# Altium schematic sheet LPF를 갖는 저항분압회로를 이용한 380V입력 전압센싱 회로1 20230822.SchDoc: 380Vac Sensing Using Resistor Divider
size A4; CheckedBy: B.C. SHIN; Author: B.C. SHIN; Address1: 개발; Address2: No; Address3: No
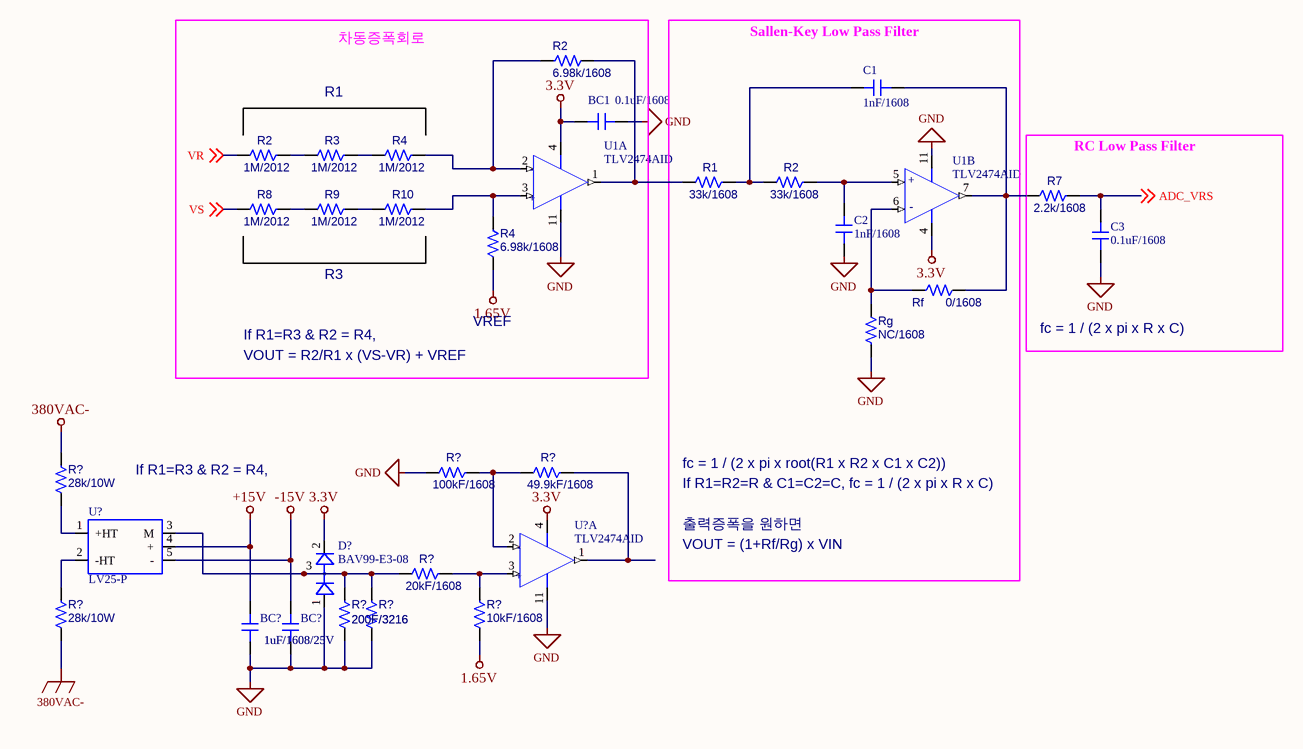
[diagram p0: LPF를 갖는 저항분압회로를 이용한 380V입력 전압센싱 회로1 20230822.SchDoc]

## Parts
(Parts that share a designator on the sheet are numbered #1, #2 ... from top to bottom, then left to right.)
BC1  0.1uF/1608  [C-1608]
BC?#1  1uF/1608/25V  [C-1608]
BC?#2  1uF/1608/25V  [C-1608]
C1  1nF/1608  [C-1608]
C2  1nF/1608  [C-1608]
C3  0.1uF/1608  [C-1608]
D?  BAV99-E3-08  [SOT-23]
R1  33k/1608  [R-1608]
R2#1  6.98k/1608  [R-1608]
R2#2  1M/2012  [R-1608]
R2#3  33k/1608  [R-1608]
R3  1M/2012  [R-1608]
R4#1  1M/2012  [R-1608]
R4#2  6.98k/1608  [R-1608]
R7  2.2k/1608  [R-1608]
R8  1M/2012  [R-1608]
R9  1M/2012  [R-1608]
R10  1M/2012  [R-1608]
R?#1  28k/10W  [R-1608]
R?#2  100kF/1608  [R-1608]
R?#3  49.9kF/1608  [R-1608]
R?#4  20kF/1608  [R-1608]
R?#5  28k/10W  [R-1608]
R?#6  200F/3216  [R-1608]
R?#7  200F/3216  [R-1608]
R?#8  10kF/1608  [R-1608]
Rf  0/1608  [R-1608]
Rg  NC/1608  [R-1608]
U1  TLV2474AID  [SO-14]  (parts A,B of 4)
U?#1  LV25-P
U?#2  TLV2474AID  [SO-14]  (part A of 4)

## Nets
1.65V: R4#2.2 R?#8.2
3.3V: BC1.2 D?.2 U1.4(+VCC) U?#2.4(+VCC)
380VAC-: R?#1.1 R?#5.2
+15V: BC?#1.1 U?#1.4(+)
-15V: BC?#2.1 U?#1.5(-)
GND: BC1.1 BC?#1.2 BC?#2.2 C2.2 C3.2 D?.1 R?#2.2 R?#6.2 R?#7.2 Rg.1 U1.11(-VCC) U?#2.11(-VCC)
ADC_VRS: C3.1 R7.1 ; off-sheet ADC_VRS
VR: R2#2.2 ; off-sheet VR
VS: R8.2 ; off-sheet VS
NetC1_1: C1.1 R1.1 R2#3.2
NetC1_2: C1.2 R7.2 Rf.2 U1.7(OUT)
NetC2_1: C2.1 R2#3.1 U1.5(+IN)
NetD?_3: D?.3 R?#4.2 R?#6.1 R?#7.1 U?#1.3(M)
NetR1_2: R1.2 R2#1.2 U1.1(OUT)
NetR2#1_1: R2#1.1 R4#1.1 U1.2(-IN)
NetR2#2_1: R2#2.1 R3.2
NetR3_1: R3.1 R4#1.2
NetR4#2_1: R4#2.1 R10.1 U1.3(+IN)
NetR8_1: R8.1 R9.2
NetR9_1: R9.1 R10.2
NetR?#1_2: R?#1.2 U?#1.1(+HT)
NetR?#2_1: R?#2.1 R?#3.2 U?#2.2(-IN)
NetR?#3_1: R?#3.1 U?#2.1(OUT)
NetR?#4_1: R?#4.1 R?#8.1 U?#2.3(+IN)
NetR?#5_1: R?#5.1 U?#1.2(-HT)
NetRf_1: Rf.1 Rg.2 U1.6(-IN)

## Notes on the sheet
- 차동증폭회로
- (near C1) Sallen-Key Low Pass Filter
- R1
- (near R7) RC Low Pass Filter
- R3
- If R1=R3 & R2 = R4,
- VOUT = R2/R1 x (VS-VR) + VREF
- VREF
- fc = 1 / (2 x pi x R x C)
- fc = 1 / (2 x pi x root(R1 x R2 x C1 x C2))
- If R1=R2=R & C1=C2=C, fc = 1 / (2 x pi x R x C)
- 출력증폭을 원하면
- VOUT = (1+Rf/Rg) x VIN
- PJT No
- This drawing is the property of SysInTeck.
- The information contained thereon may not be used
- or the drawing reproduced without written permission
- from SysInTeck.
- 이 도면은 시스인텍의 지적자산입니다. 따라서 시스인텍의 동의 없이
- 본 회로의 전체  또는 일부를 발취하여 사용하는 행위는 위법임을
- 알려드립니다.
- DrawnBy
- CheckedBy
- PCB No.
- Title
- Size
- A4
- DocumentNumber
- SysInTeck
- Rev
- BOM No.
- Date
- Sheet
- of
- (in symbol OPA4336_1, part A) -; +
- (in symbol OPA4336_1, part B) +; -

## Library data of the parts
BC1 BC?#1 BC?#2 C1-C3 = CAPACITOR NON-POL_1: PCB Footprint: C-1608
D? = BAV99-E3-08: DIODE ARRAY GP 70V 150MA SOT23
R1 R2#1-R2#3 R3 R4#1 R4#2 R7-R10 R?#1-R?#8 Rf Rg = R_Dup1: OriginalSymbolOrigin: (0,0); PSpiceTemplate: R^@REFDES %1 %2 ?TOLERANCE|R^@REFDES| @VALUE  ?TOLERANCE|\n.model R^@REFDES RES R=1 DEV=@TOLERANCE%|; Value: 6.98kF/1608; PCB Footprint: R-1608
U1 U?#2 = OPA4336_1: PCB Footprint: SO-14